# Altium schematic sheet b2b_connector.SchDoc: DiPho digital
size 420 x 297 mm; Author: Piotr Daniel; DrawnBy: P. Daniel; Address1: WUT ISE; Address3: piotrmaciejdaniel@gmail.com; Revision: 1; SheetNumber: 4; SheetTotal: 4; Title2: b2b con schematic; Designer: Piotr Daniel; CreateDate: 10-12.2021
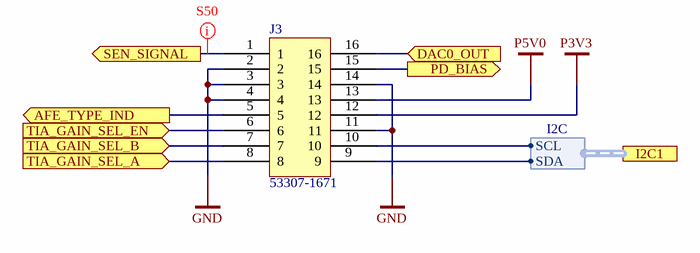
[diagram p0: b2b_connector.SchDoc]

## Parts
J3  53307-1671  [533071671]

## Ports
AFE_TYPE_IND (out), DAC0_OUT (in), I2C1 (harness I2C), PD_BIAS (out), SEN_SIGNAL (out), TIA_GAIN_SEL_A (in), TIA_GAIN_SEL_B (in), TIA_GAIN_SEL_EN (in)

## Harnesses
I2C: SCL, SDA

## Nets
GND: J3.2 J3.3 J3.4 J3.11 J3.14
P3V3: J3.12
P5V0: J3.13
AFE_TYPE_IND: J3.5 ; port AFE_TYPE_IND
DAC0_OUT: J3.16 ; port DAC0_OUT
PD_BIAS: J3.15 ; port PD_BIAS
SEN_SIGNAL: J3.1 ; port SEN_SIGNAL
TIA_GAIN_SEL_A: J3.8 ; port TIA_GAIN_SEL_A
TIA_GAIN_SEL_B: J3.7 ; port TIA_GAIN_SEL_B
TIA_GAIN_SEL_EN: J3.6 ; port TIA_GAIN_SEL_EN
NetJ3_9: J3.9 ; port I2C1.SDA
NetJ3_10: J3.10 ; port I2C1.SCL

## Layout directives
rule Width Constraint [Pref Impedance = 50,00ohms    Min Impedance = 50,00ohms    Max Impedance = 50,00ohms]: SEN_SIGNAL

## Notes on the sheet
- Project/Equipment
- Document
- Designer
- Drawn by
- Check.by
- Copyright WUT ISE 2021.
  This documentation describes Open Hardware and is licensed under the CERN OHL v.1.1. You may redistribute and modify this documentation under the terms of the CERN OHL v.1.1. (http://ohwr.org/CERNOHL). This documentation is distributed WITHOUT ANY EXPRESS OR IMPLIED WARRANTY, INCLUDING OF MERCHANTABILITY, SATISFACTORY QUALITY AND FITNESS FOR A PARTICULAR PURPOSE. Please see the CERN OHL v.1.1 for applicable conditions.
- Contact
- File
- Last Mod.
- Print Date
- Sheet
- Size
- A3
- of
- Rev

## Library data of the parts
J3 = 53307-1671: 0.80mm Pitch Header Surface Mount Dual Row Vertical Stacking 4.50 and 5.50mm Stacking Heights 16 Circuits; Manufacturer: Molex; Supplier 1: Farnell; Manufacturer Part Number: 53307-1671; RoHS: Yes; Category: Headers and Wire Housings; Stock 1: 7000; ComponentLink1URL: https://datasheet.ciiva.com/5130/0533071671-pcb-headers-170920-5130475.pdf?src-supplier=Mouser; ComponentLink1Description: https://datasheet.ciiva.com/5130/0533071671-pcb-headers-170920-5130475.pdf?src-supplier=Mouser; ComponentLink2URL: https://datasheet.ciiva.com/1440/1875052-1440388.pdf?src-supplier=Element14; ComponentLink2Description: https://datasheet.ciiva.com/1440/1875052-1440388.pdf?src-supplier=Element14; ComponentLink3URL: https://datasheet.ciiva.com/10079/0533071671-pcb-headers-10079144.pdf?src-supplier=Avnet; ComponentLink3Description: https://datasheet.ciiva.com/10079/0533071671-pcb-headers-10079144.pdf?src-supplier=Avnet; Supplier Part Number 1: 3499278